# Altium schematic sheet QSPI_FLASH.SchDoc: FPGA Peripherals Board - FLASH
size A4; Author: mayerph; DrawnBy: mayerph; Organization: IIS; Revision: PA; SheetNumber: 5; SheetTotal: 7
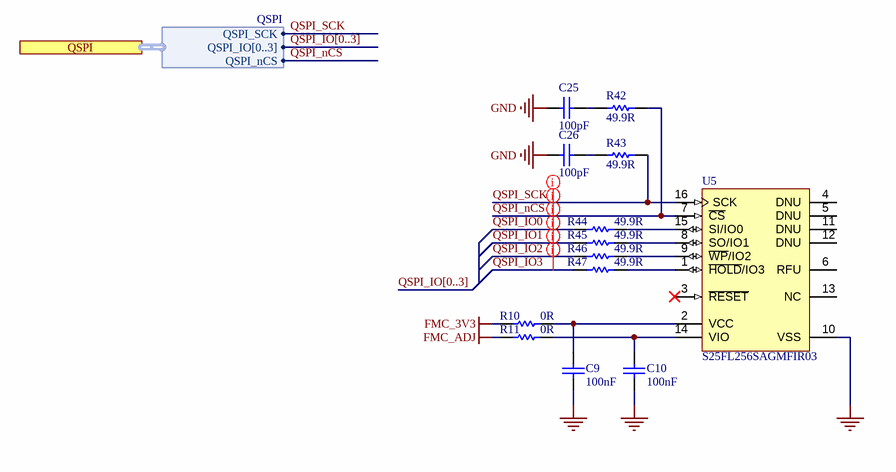
[diagram p0: QSPI_FLASH.SchDoc]

## Parts
C9  100nF  [CAPC1050X55X23LL05T13]
C10  100nF  [CAPC1050X55X23LL05T13]
C25  100pF  [CAPC0603X33X15LL03T05]
C26  100pF  [CAPC0603X33X15LL03T05]
R10  0R  [RESC1005X40X25LL05T10]
R11  0R  [RESC1005X40X25LL05T10]
R42  49.9R  [RESC0603X26X15LL03T05]
R43  49.9R  [RESC0603X26X15LL03T05]
R44  49.9R  [RESC0603X26X15LL03T05]
R45  49.9R  [RESC0603X26X15LL03T05]
R46  49.9R  [RESC0603X26X15LL03T05]
R47  49.9R  [RESC0603X26X15LL03T05]
U5  S25FL256SAGMFIR03  [SOIC127P1030X265-16N]

## Ports
QSPI (harness QSPI)

## Harnesses
QSPI: QSPI_SCK, QSPI_IO[0..3], QSPI_nCS

## Nets
FMC_3V3: R10.2
FMC_ADJ: R11.2
GND: C9.1 C10.1 C25.2 C26.2 U5.10(VSS)
QSPI_IO0: R44.2
QSPI_IO1: R45.2
QSPI_IO2: R46.2
QSPI_IO3: R47.2
QSPI_nCS: R42.1 U5.7(~{CS}) ; port QSPI.QSPI_nCS
QSPI_SCK: R43.1 U5.16(SCK) ; port QSPI.QSPI_SCK
NetC9_2: C9.2 R10.1 U5.2(VCC)
NetC10_2: C10.2 R11.1 U5.14(VIO)
NetC25_1: C25.1 R42.2
NetC26_1: C26.1 R43.2
NetR44_1: R44.1 U5.15(SI/IO0)
NetR45_1: R45.1 U5.8(SO/IO1)
NetR46_1: R46.1 U5.9(~{WP}/IO2)
NetR47_1: R47.1 U5.1(~{HOLD}/IO3)

Not connected (* = marked no-connect by the designer): U5 3(~{RESET})* 4(DNU) 5(DNU) 6(RFU) 11(DNU) 12(DNU) 13(NC)

## Buses and harness runs
bus QSPI_IO[0..3]

## Layout directives
net class QSPI0: QSPI_IO0, QSPI_IO1, QSPI_IO2, QSPI_IO3, QSPI_nCS, QSPI_SCK

## Notes on the sheet
- 1
- 2
- 3
- 4
- A
- B
- C
- Project:
- D
- Date:
- Drawing number:
- Rev:
- Format:
- A4 Q
- Drawn by:
- Laboratory:
- Page
- Sheet:
- of
- File:

## Library data of the parts
C9 C10 = CMP-2000-05439-1: Chip Capacitor, 100 nF, +/- 10%, 16 V, -55 to 125 degC, 0402 (1005 Metric), RoHS, Tape and Reel; Manufacturer: Samsung Electro-Mechanics; Manufacturer Part Number: CL05B104KO5NNNC; Dielectric: X7R; Rated Voltage: 16V; Material: Ceramic; Case Size/Dimension: 0402; Tolerance (%): ±10%; Value: 100nF; Manufacturer URL: http://www.samsungsem.com/global/index.jsp; Datasheet URL: https://datasheet.ciiva.com/29198/458718-da-01-en-vs-kondensator-0402-29198423.pdf; Datasheet Version: Nov-10; Supplier 1: Digi-Key; Supplier Part Number 1: 1276-1001-1-ND; RoHS: Yes; Category: Ceramic Capacitors; Stock 1: 18886859; Pricing 1: 1=0.10000, 10=0.02800, 50=0.01520, 100=0.01240, 500=0.00886, 1000=0.00696, 2500=0.00632, 5000=0.00582 (USD); Mount: Surface Mount; Case/Package: 0402; Case Code (Metric): 1005; Case Code (Imperial): 0402; Contact Plating: Tin; Min Operating Temperature: -55°C; Max Operating Temperature: 125°C; Tolerance: 10%; Packaging: Tape and Reel; Voltage Rating: 16V; Voltage Rating (DC): 16V; Package Quantity: 1; Voltage: 16V; Length: 1mm; Height: 0.5mm; Width: 0.02inch; Depth: 0.5mm; Thickness: 0.022inch; Radiation Hardening: No; Lead Free: Lead Free; ComponentLink1URL: https://datasheet.ciiva.com/26920/getdatasheetpartid-359683-26920169.pdf?src-supplier=Verical; ComponentLink1Description: https://datasheet.ciiva.com/26920/getdatasheetpartid-359683-26920169.pdf?src-supplier=Verical; ComponentLink2URL: https://datasheet.ciiva.com/29198/458718-da-01-en-vs-kondensator-0402-29198423.pdf?src-supplier=Conrad; ComponentLink2Description: https://datasheet.ciiva.com/29198/458718-da-01-en-vs-kondensator-0402-29198423.pdf?src-supplier=Conrad; ComponentLink3URL: https://datasheet.ciiva.com/16208/cl05b104kq5nnnc-16208343.pdf?src-supplier=Future+Electronics; ComponentLink3Description: https://datasheet.ciiva.com/16208/cl05b104kq5nnnc-16208343.pdf?src-supplier=Future+Electronics; ComponentLink4URL: https://datasheet.ciiva.com/26309/mlcc-catalogdownload2013-eng-26309003.pdf?src-supplier=Distrelec; ComponentLink4Description: https://datasheet.ciiva.com/26309/mlcc-catalogdownload2013-eng-26309003.pdf?src-supplier=Distrelec
C25 C26 = CMP-1033-00489-2: Part Number: 0201YC101KAT2A; Manufacturer: AVX Interconnect / Elco; Dielectric Material: Ceramic; Tolerance: 10%; Voltage Rating: 16V; Dielectric: X7R; Supplier 1: Digi-Key; Supplier Part Number 1: 478-1027-1-ND; Manufacturer Part Number: 0201YC101KAT2A; RoHS: Yes; Category: Ceramic Capacitors; Stock 1: 18398; Pricing 1: 1=0.36000, 10=0.24800, 50=0.17320, 100=0.14850, 500=0.11138, 1000=0.09405, 2500=0.08910, 5000=0.08415 (USD); Mount: Surface Mount; Case/Package: 0201; Number of Pins: 2; Case Code (Metric): 0603; Case Code (Imperial): 0201; Min Operating Temperature: -55°C; Max Operating Temperature: 125°C; Value: 100pF; Packaging: Tape and Reel; Package Quantity: 15000; Voltage Rating (DC): 16V; Termination: SMD/SMT; Series: -; Construction: Flat; Length: 0.6mm; Width: 0.012inch; Thickness: 0.013inch; Depth: 0.3mm; Radiation Hardening: No; RoHS Compliant: Yes; Lead Free: Lead Free; REACH SVHC: No SVHC; ComponentLink1URL: https://datasheet.ciiva.com/152/cx7r-152514.pdf?src-supplier=Digi-Key; ComponentLink1Description: https://datasheet.ciiva.com/152/cx7r-152514.pdf?src-supplier=Digi-Key; ComponentLink2URL: https://datasheet.ciiva.com/152/cx7r-152515.pdf?src-supplier=Digi-Key; ComponentLink2Description: https://datasheet.ciiva.com/152/cx7r-152515.pdf?src-supplier=Digi-Key; ComponentLink3URL: https://datasheet.ciiva.com/152/cx7r-152516.pdf?src-supplier=Digi-Key; ComponentLink3Description: https://datasheet.ciiva.com/152/cx7r-152516.pdf?src-supplier=Digi-Key; ComponentLink4URL: https://datasheet.ciiva.com/5427/cx7r-218113-5427893.pdf?src-supplier=Mouser; ComponentLink4Description: https://datasheet.ciiva.com/5427/cx7r-218113-5427893.pdf?src-supplier=Mouser; ComponentLink5URL: https://datasheet.ciiva.com/2990/cx7r-2990106.pdf?src-supplier=Avnet; ComponentLink5Description: https://datasheet.ciiva.com/2990/cx7r-2990106.pdf?src-supplier=Avnet; ComponentLink6URL: https://datasheet.ciiva.com/16328/cx7r-16328234.pdf?src-supplier=Future+Electronics; ComponentLink6Description: https://datasheet.ciiva.com/16328/cx7r-16328234.pdf?src-supplier=Future+Electronics; ComponentLink7URL: https://datasheet.ciiva.com/1123/683218-1123133.pdf?src-supplier=Element14; ComponentLink7Description: https://datasheet.ciiva.com/1123/683218-1123133.pdf?src-supplier=Element14; ComponentLink8URL: https://datasheet.ciiva.com/2987/cx7r-2987629.pdf?src-supplier=Avnet; ComponentLink8Description: https://datasheet.ciiva.com/2987/cx7r-2987629.pdf?src-supplier=Avnet
R10 R11 = CMP-2002-07912-1: Manufacturer: Yageo; Part Number: RC0402JR-070RL; Value: 0 Ohm; Power Rating: 62.5mW; Tolerance: 5%; Voltage Rating: 50V; Temperature Coefficient: 200ppm/°C; Max Power Dissipation: 63mW; Supplier 1: Digi-Key; Supplier Part Number 1: 311-0.0JRCT-ND; Manufacturer Part Number: RC0402JR-070RL; RoHS: Yes; Category: Chip SMD Resistors; Stock 1: 44193294; Pricing 1: 1=0.10000, 10=0.01200, 25=0.00840, 50=0.00640, 100=0.00480, 250=0.00364, 500=0.00292, 1000=0.00215, 5000=0.00154 (USD); Case/Package: 0402; Contact Plating: Tin,Matte; Case Code (Metric): 1005; Case Code (Imperial): 0402; Min Operating Temperature: -55°C; Max Operating Temperature: 155°C; Resistor Type: Thick Film; Packaging: Tape and Reel; Termination: SMD/SMT; Package Quantity: 1; Number of Terminations: 2; Features: Moisture Resistant; Length: 1mm; Height: 0.016inch; Width: 0.02inch; Depth: 0.5mm; Radiation Hardening: No; Lead Free: Lead Free; REACH SVHC: Unknown; Military Standard: Not; ComponentLink1URL: https://datasheet.ciiva.com/2452/pyu-rc0402-51-rohs-l-6-2452608.pdf?src-supplier=Digi-Key; ComponentLink1Description: https://datasheet.ciiva.com/2452/pyu-rc0402-51-rohs-l-6-2452608.pdf?src-supplier=Digi-Key; ComponentLink2URL: https://datasheet.ciiva.com/11808/0900766b80c66297-11808195.pdf?src-supplier=RSComponents; ComponentLink2Description: https://datasheet.ciiva.com/11808/0900766b80c66297-11808195.pdf?src-supplier=RSComponents; ComponentLink3URL: https://datasheet.ciiva.com/2452/pyu-r-int-thick-7-2452609.pdf?src-supplier=Digi-Key; ComponentLink3Description: https://datasheet.ciiva.com/2452/pyu-r-int-thick-7-2452609.pdf?src-supplier=Digi-Key; ComponentLink4URL: https://datasheet.ciiva.com/2452/pyu-r-int-thick-7-2452610.pdf?src-supplier=Digi-Key; ComponentLink4Description: https://datasheet.ciiva.com/2452/pyu-r-int-thick-7-2452610.pdf?src-supplier=Digi-Key; ComponentLink5URL: https://datasheet.ciiva.com/8896/pyu-rc0402-51-rohs-l-6-8896201.pdf?src-supplier=Avnet; ComponentLink5Description: https://datasheet.ciiva.com/8896/pyu-rc0402-51-rohs-l-6-8896201.pdf?src-supplier=Avnet; ComponentLink6URL: https://datasheet.ciiva.com/28386/pyu-rc0402-51-rohs-l-6-28386633.pdf?src-supplier=Avnet+Europe; ComponentLink6Description: https://datasheet.ciiva.com/28386/pyu-rc0402-51-rohs-l-6-28386633.pdf?src-supplier=Avnet+Europe; ComponentLink7URL: https://datasheet.ciiva.com/22747/1018594-22747515.pdf?src-supplier=Element14; ComponentLink7Description: https://datasheet.ciiva.com/22747/1018594-22747515.pdf?src-supplier=Element14; ComponentLink8URL: https://datasheet.ciiva.com/15189/getdatasheetpartid-326379-15189533.pdf?src-supplier=Verical; ComponentLink8Description: https://datasheet.ciiva.com/15189/getdatasheetpartid-326379-15189533.pdf?src-supplier=Verical; ComponentLink9URL: https://datasheet.ciiva.com/7983/1018594-7983535.pdf?src-supplier=Element14; ComponentLink9Description: https://datasheet.ciiva.com/7983/1018594-7983535.pdf?src-supplier=Element14
R42-R47 = CMP-2004-02983-1: Manufacturer: Panasonic; Part Number: ERJ-1GEF49R9C; Value: 49.9 Ohm; Tolerance: 1%; Temperature Coefficient: 200ppm/°C; Max Power Dissipation: 50mW; Voltage Rating: 25V; Voltage Rating (DC): 15V; Supplier 1: Digi-Key; Supplier Part Number 1: P49.9ABCT-ND; Manufacturer Part Number: ERJ-1GEF49R9C; RoHS: Yes; Category: Chip SMD Resistors; Stock 1: 2; Pricing 1: 1=0.10000, 10=0.03800, 100=0.01530, 1000=0.00689, 2500=0.00598, 5000=0.00494 (USD); Mount: Surface Mount; Case/Package: 0201; Case Code (Metric): 0603; Case Code (Imperial): 0201; Contact Plating: Tin; Min Operating Temperature: -55°C; Max Operating Temperature: 125°C; Packaging: Tape and Reel; Resistor Type: Thick Film; Number of Terminations: 2; Power Rating: 50mW; Package Quantity: 1; Series: ERJ; Termination: SMD/SMT; Construction: Rectangular; Resistance Tolerance: 1%; Technology: THICK FILM; Working Voltage: 25V; Length: 0.6mm; Width: 0.012inch; Height: 0.23mm; Depth: 0.3mm; Radiation Hardening: No; RoHS Compliant: Yes; Lead Free: Lead Free; Military Standard: Not; REACH SVHC: Unknown; ComponentLink1URL: https://datasheet.ciiva.com/16201/erj-1gef49r9c-16201490.pdf?src-supplier=Future+Electronics; ComponentLink1Description: https://datasheet.ciiva.com/16201/erj-1gef49r9c-16201490.pdf?src-supplier=Future+Electronics; ComponentLink2URL: https://datasheet.ciiva.com/2439/erj-g-r-e-rev08-2439298.pdf?src-supplier=Digi-Key; ComponentLink2Description: https://datasheet.ciiva.com/2439/erj-g-r-e-rev08-2439298.pdf?src-supplier=Digi-Key; ComponentLink3URL: https://datasheet.ciiva.com/2439/erj-g-r-e-rev08-2439299.pdf?src-supplier=Digi-Key; ComponentLink3Description: https://datasheet.ciiva.com/2439/erj-g-r-e-rev08-2439299.pdf?src-supplier=Digi-Key; ComponentLink4URL: https://datasheet.ciiva.com/2439/erj-g-r-e-rev08-2439300.pdf?src-supplier=Digi-Key; ComponentLink4Description: https://datasheet.ciiva.com/2439/erj-g-r-e-rev08-2439300.pdf?src-supplier=Digi-Key; ComponentLink5URL: https://datasheet.ciiva.com/16777/70260683-16777270.pdf?src-supplier=Allied+Electronics; ComponentLink5Description: https://datasheet.ciiva.com/16777/70260683-16777270.pdf?src-supplier=Allied+Electronics; ComponentLink6URL: https://datasheet.ciiva.com/28548/1694929-28548246.pdf?src-supplier=Element14; ComponentLink6Description: https://datasheet.ciiva.com/28548/1694929-28548246.pdf?src-supplier=Element14; ComponentLink7URL: https://datasheet.ciiva.com/30159/aoa0000ce2-30159798.pdf?src-supplier=Onlinecomponents.com; ComponentLink7Description: https://datasheet.ciiva.com/30159/aoa0000ce2-30159798.pdf?src-supplier=Onlinecomponents.com; ComponentLink8URL: https://datasheet.ciiva.com/7920/1678796-7920599.pdf?src-supplier=Element14; ComponentLink8Description: https://datasheet.ciiva.com/7920/1678796-7920599.pdf?src-supplier=Element14
U5 = CMP-00165-1: NOR Flash Serial-SPI 3V 256M-bit 256M x 1bit 8ns 16-Pin SOIC; Manufacturer: Cypress Semiconductor Corp; Memory Type: FLASH - NOR; Memory Size: 256M (32M x 8); Speed: 133MHz; Interface: SPI Serial; Voltage - Supply: 2.7 V ~ 3.6 V; Packaging: *; Format - Memory: FLASH; Operating Temperature: -40°C ~ 85°C (TA); Supplier Device Package: 16-SO; Manufacturer Part Number: S25FL256SAGMFIR03; Supplier: Digi-Key; Supplier Part Number: S25FL256SAGMFIR03-ND; ComponentLink1Description: download; ComponentLink1URL: http://www.cypress.com/file/177966/download